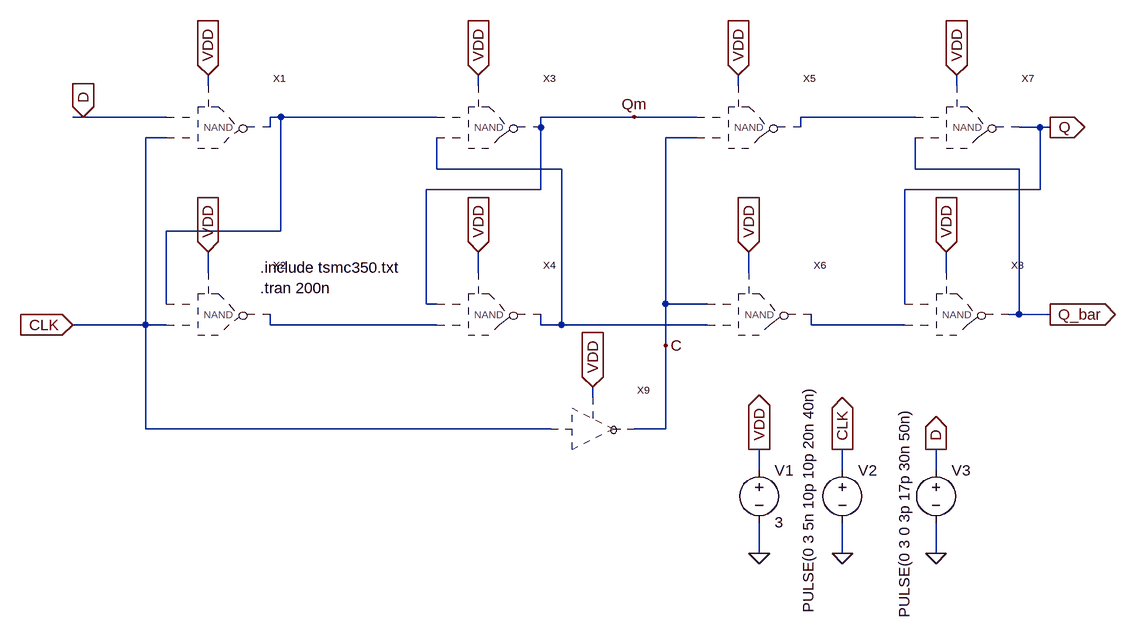
[diagram p0: schematic lab9t2.asc]
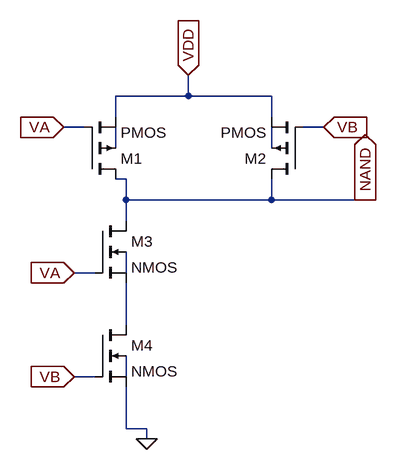
[diagram p1: sub-circuit nand.asc]
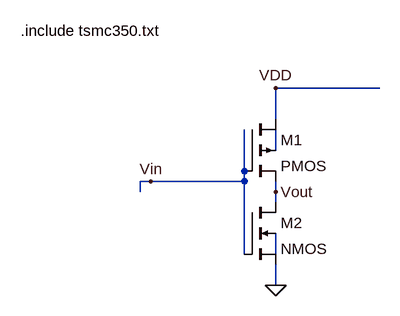
[diagram p2: sub-circuit symb.asc]
lab9t2.asc, the LTspice schematic file:
Version 4
SHEET 1 1200 956
WIRE -208 128 -208 112
WIRE 208 128 208 112
WIRE 608 128 608 112
WIRE 944 128 944 112
WIRE -400 176 -416 176
WIRE -272 176 -400 176
WIRE -96 176 -112 176
WIRE 144 176 -96 176
WIRE 448 176 304 176
WIRE 544 176 448 176
WIRE 880 176 704 176
WIRE -112 192 -112 176
WIRE 304 192 304 176
WIRE 704 192 704 176
WIRE 1072 192 1040 192
WIRE 1088 192 1072 192
WIRE -272 208 -304 208
WIRE 544 208 496 208
WIRE 144 256 144 208
WIRE 336 256 144 256
WIRE 880 256 880 208
WIRE 1040 256 880 256
WIRE 304 288 304 192
WIRE 304 288 128 288
WIRE 1072 288 1072 192
WIRE 1072 288 864 288
WIRE -96 352 -96 176
WIRE -96 352 -272 352
WIRE -208 416 -208 384
WIRE 208 416 208 384
WIRE 624 416 624 384
WIRE 928 416 928 384
WIRE -272 464 -272 352
WIRE 128 464 128 288
WIRE 144 464 128 464
WIRE 496 464 496 208
WIRE 560 464 496 464
WIRE 864 464 864 288
WIRE 1040 480 1040 256
WIRE 1040 480 1024 480
WIRE 1088 480 1040 480
WIRE -304 496 -304 208
WIRE -304 496 -416 496
WIRE -272 496 -304 496
WIRE -112 496 -112 480
WIRE 144 496 -112 496
WIRE 304 496 304 480
WIRE 336 496 336 256
WIRE 336 496 304 496
WIRE 560 496 336 496
WIRE 720 496 720 480
WIRE 864 496 720 496
WIRE 496 528 496 464
WIRE 384 608 384 592
WIRE -304 656 -304 496
WIRE 320 656 -304 656
WIRE 496 656 496 528
WIRE 496 656 448 656
WIRE 640 720 640 688
WIRE 768 720 768 688
WIRE 912 720 912 688
WIRE 640 848 640 800
WIRE 768 848 768 800
WIRE 912 848 912 800
FLAG 944 112 VDD
IOPIN 944 112 In
FLAG 608 112 VDD
IOPIN 608 112 In
FLAG 208 112 VDD
IOPIN 208 112 In
FLAG -208 112 VDD
IOPIN -208 112 In
FLAG -208 384 VDD
IOPIN -208 384 In
FLAG 208 384 VDD
IOPIN 208 384 In
FLAG 624 384 VDD
IOPIN 624 384 In
FLAG 928 384 VDD
IOPIN 928 384 In
FLAG 384 592 VDD
IOPIN 384 592 In
FLAG -400 176 D
IOPIN -400 176 In
FLAG -416 496 CLK
IOPIN -416 496 In
FLAG 1088 192 Q
IOPIN 1088 192 Out
FLAG 1088 480 Q_bar
IOPIN 1088 480 Out
FLAG 640 848 0
FLAG 768 848 0
FLAG 912 848 0
FLAG 640 688 VDD
IOPIN 640 688 Out
FLAG 768 688 CLK
IOPIN 768 688 Out
FLAG 912 688 D
IOPIN 912 688 Out
FLAG 496 528 C
FLAG 448 176 Qm
SYMBOL NAND -176 192 R0
SYMATTR InstName X1
SYMBOL NAND -176 480 R0
SYMATTR InstName X2
SYMBOL NAND 240 192 R0
SYMATTR InstName X3
SYMBOL NAND 240 480 R0
SYMATTR InstName X4
SYMBOL NAND 640 192 R0
SYMATTR InstName X5
SYMBOL NAND 656 480 R0
SYMATTR InstName X6
SYMBOL NAND 976 192 R0
SYMATTR InstName X7
SYMBOL NAND 960 480 R0
SYMATTR InstName X8
SYMBOL symb 384 656 R0
SYMATTR InstName X9
SYMBOL Voltage 640 704 R0
SYMATTR InstName V1
SYMATTR Value 3
SYMBOL Voltage 768 704 R0
WINDOW 3 -52 -115 VRight 2
SYMATTR Value PULSE(0 3 5n 10p 10p 20n 40n)
SYMATTR InstName V2
SYMBOL Voltage 912 704 R0
WINDOW 3 -49 -81 VRight 2
SYMATTR Value PULSE(0 3 0 3p 17p 30n 50n)
SYMATTR InstName V3
TEXT -128 408 Left 2 !.include tsmc350.txt\n.tran 200n

nand.asc, the sub-circuit schematic file:
Version 4
SHEET 1 880 680
WIRE 416 112 416 80
WIRE 416 112 304 112
WIRE 544 112 416 112
WIRE 304 144 304 112
WIRE 544 144 544 112
WIRE 256 160 224 160
WIRE 624 160 592 160
WIRE 304 192 304 160
WIRE 544 192 544 160
WIRE 320 240 304 240
WIRE 320 272 320 240
WIRE 544 272 544 240
WIRE 544 272 320 272
WIRE 688 272 544 272
WIRE 704 272 688 272
WIRE 320 304 320 272
WIRE 272 384 240 384
WIRE 320 384 320 352
WIRE 320 464 320 400
WIRE 272 544 240 544
WIRE 320 544 320 512
WIRE 320 624 320 560
WIRE 352 624 320 624
WIRE 352 640 352 624
FLAG 352 640 0
FLAG 416 80 VDD
IOPIN 416 80 In
FLAG 688 272 NAND
IOPIN 688 272 Out
FLAG 624 160 VB
IOPIN 624 160 In
FLAG 224 160 VA
IOPIN 224 160 In
FLAG 240 384 VA
IOPIN 240 384 In
FLAG 240 544 VB
IOPIN 240 544 In
SYMBOL pmos4 256 240 M180
SYMATTR InstName M1
SYMATTR Value2 l=350n w=40u
SYMBOL pmos4 592 240 R180
SYMATTR InstName M2
SYMATTR Value2 l=350n w=40u
SYMBOL nmos4 272 304 R0
SYMATTR InstName M3
SYMATTR Value2 l=350n w=4u
SYMBOL nmos4 272 464 R0
SYMATTR InstName M4
SYMATTR Value2 l=350n w=4u

symb.asc, the sub-circuit schematic file:
Version 4
SHEET 1 880 680
WIRE 560 176 400 176
WIRE 400 224 400 176
WIRE 400 272 400 240
WIRE 352 304 352 240
WIRE 208 320 192 320
WIRE 352 320 352 304
WIRE 352 320 208 320
WIRE 192 336 192 320
WIRE 400 336 400 320
WIRE 400 352 400 336
WIRE 352 432 352 320
WIRE 400 432 400 400
WIRE 400 480 400 448
FLAG 400 480 0
FLAG 208 320 Vin
FLAG 400 176 VDD
FLAG 400 336 Vout
SYMBOL pmos4 352 224 R0
SYMATTR InstName M1
SYMATTR Value2 l=350n w=2u
SYMBOL nmos4 352 352 R0
SYMATTR InstName M2
SYMATTR Value2 l=350n w=1u
TEXT 8 88 Left 2 !.include tsmc350.txt

The netlist it stands for:
* lab9t2.asc
XX1 D CLK VDD N001 nand
XX2 N001 CLK VDD N004 nand
XX3 N001 N003 VDD Qm nand
XX4 Qm N004 VDD N003 nand
XX5 Qm C VDD N002 nand
XX6 C N003 VDD N005 nand
XX7 N002 Q_bar VDD Q nand
XX8 Q N005 VDD Q_bar nand
XX9 CLK VDD C symb
V1 VDD 0 3
V2 CLK 0 PULSE(0 3 5n 10p 10p 20n 40n)
V3 D 0 PULSE(0 3 0 3p 17p 30n 50n)

* block symbol definitions
.subckt nand VA VB VDD NAND
M1 NAND VA VDD N001 PMOS l=350n w=40u
M2 NAND VB VDD N002 PMOS l=350n w=40u
M3 NAND VA N004 N003 NMOS l=350n w=4u
M4 N004 VB 0 N005 NMOS l=350n w=4u
.ends nand

.subckt symb Vin VDD Vout
M1 VDD Vin Vout N001 PMOS l=350n w=2u
M2 Vout Vin 0 N002 NMOS l=350n w=1u
.include tsmc350.txt
.ends symb

.model NMOS NMOS
.model PMOS PMOS
.lib standard.mos
.include tsmc350.txt
.tran 200n
.backanno
.end